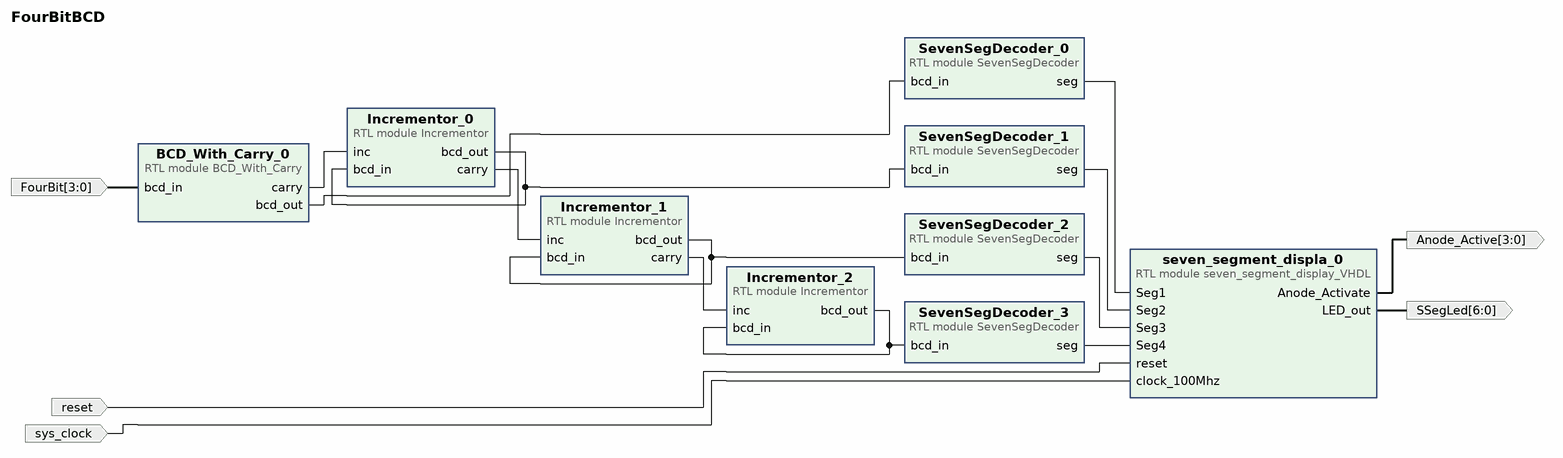
[diagram p0: block diagram of the top level]
# Vivado block design FourBitBCD, xc7a100tcsg324-1, Vivado 2025.1
create_bd_design FourBitBCD

create_bd_port -dir I -from 3 -to 0 FourBit
create_bd_port -dir O -from 6 -to 0 SSegLed
create_bd_port -dir O -from 3 -to 0 Anode_Active
create_bd_port -dir I -type clk sys_clock
set_property -dict {CONFIG.FREQ_HZ 100000000} [get_bd_ports sys_clock]
create_bd_port -dir I -type rst reset
set_property -dict {CONFIG.POLARITY ACTIVE_HIGH} [get_bd_ports reset]

create_bd_cell -type module -reference BCD_With_Carry BCD_With_Carry_0
create_bd_cell -type module -reference SevenSegDecoder SevenSegDecoder_0
create_bd_cell -type module -reference Incrementor Incrementor_0
create_bd_cell -type module -reference Incrementor Incrementor_1
create_bd_cell -type module -reference SevenSegDecoder SevenSegDecoder_1
create_bd_cell -type module -reference Incrementor Incrementor_2
create_bd_cell -type module -reference SevenSegDecoder SevenSegDecoder_2
create_bd_cell -type module -reference SevenSegDecoder SevenSegDecoder_3
create_bd_cell -type module -reference seven_segment_display_VHDL seven_segment_displa_0

# ---- connections ----

connect_bd_net [get_bd_pins BCD_With_Carry_0/bcd_out] [get_bd_pins SevenSegDecoder_0/bcd_in]
connect_bd_net [get_bd_pins BCD_With_Carry_0/carry] [get_bd_pins Incrementor_0/inc]
connect_bd_net [get_bd_ports FourBit] [get_bd_pins BCD_With_Carry_0/bcd_in]
connect_bd_net [get_bd_pins Incrementor_0/bcd_out] [get_bd_pins Incrementor_0/bcd_in] [get_bd_pins SevenSegDecoder_1/bcd_in]
connect_bd_net [get_bd_pins Incrementor_0/carry] [get_bd_pins Incrementor_1/inc]
connect_bd_net [get_bd_pins Incrementor_1/bcd_out] [get_bd_pins Incrementor_1/bcd_in] [get_bd_pins SevenSegDecoder_2/bcd_in]
connect_bd_net [get_bd_pins Incrementor_1/carry] [get_bd_pins Incrementor_2/inc]
connect_bd_net [get_bd_pins Incrementor_2/bcd_out] [get_bd_pins Incrementor_2/bcd_in] [get_bd_pins SevenSegDecoder_3/bcd_in]
connect_bd_net [get_bd_pins SevenSegDecoder_0/seg] [get_bd_pins seven_segment_displa_0/Seg1]
connect_bd_net [get_bd_pins SevenSegDecoder_1/seg] [get_bd_pins seven_segment_displa_0/Seg2]
connect_bd_net [get_bd_pins SevenSegDecoder_2/seg] [get_bd_pins seven_segment_displa_0/Seg3]
connect_bd_net [get_bd_pins SevenSegDecoder_3/seg] [get_bd_pins seven_segment_displa_0/Seg4]
connect_bd_net [get_bd_ports reset] [get_bd_pins seven_segment_displa_0/reset]
connect_bd_net [get_bd_pins seven_segment_displa_0/Anode_Activate] [get_bd_ports Anode_Active]
connect_bd_net [get_bd_pins seven_segment_displa_0/LED_out] [get_bd_ports SSegLed]
connect_bd_net [get_bd_ports sys_clock] [get_bd_pins seven_segment_displa_0/clock_100Mhz]

validate_bd_design
save_bd_design
